# EAGLE design raspi-gsm-relais (EAGLE 6.4)
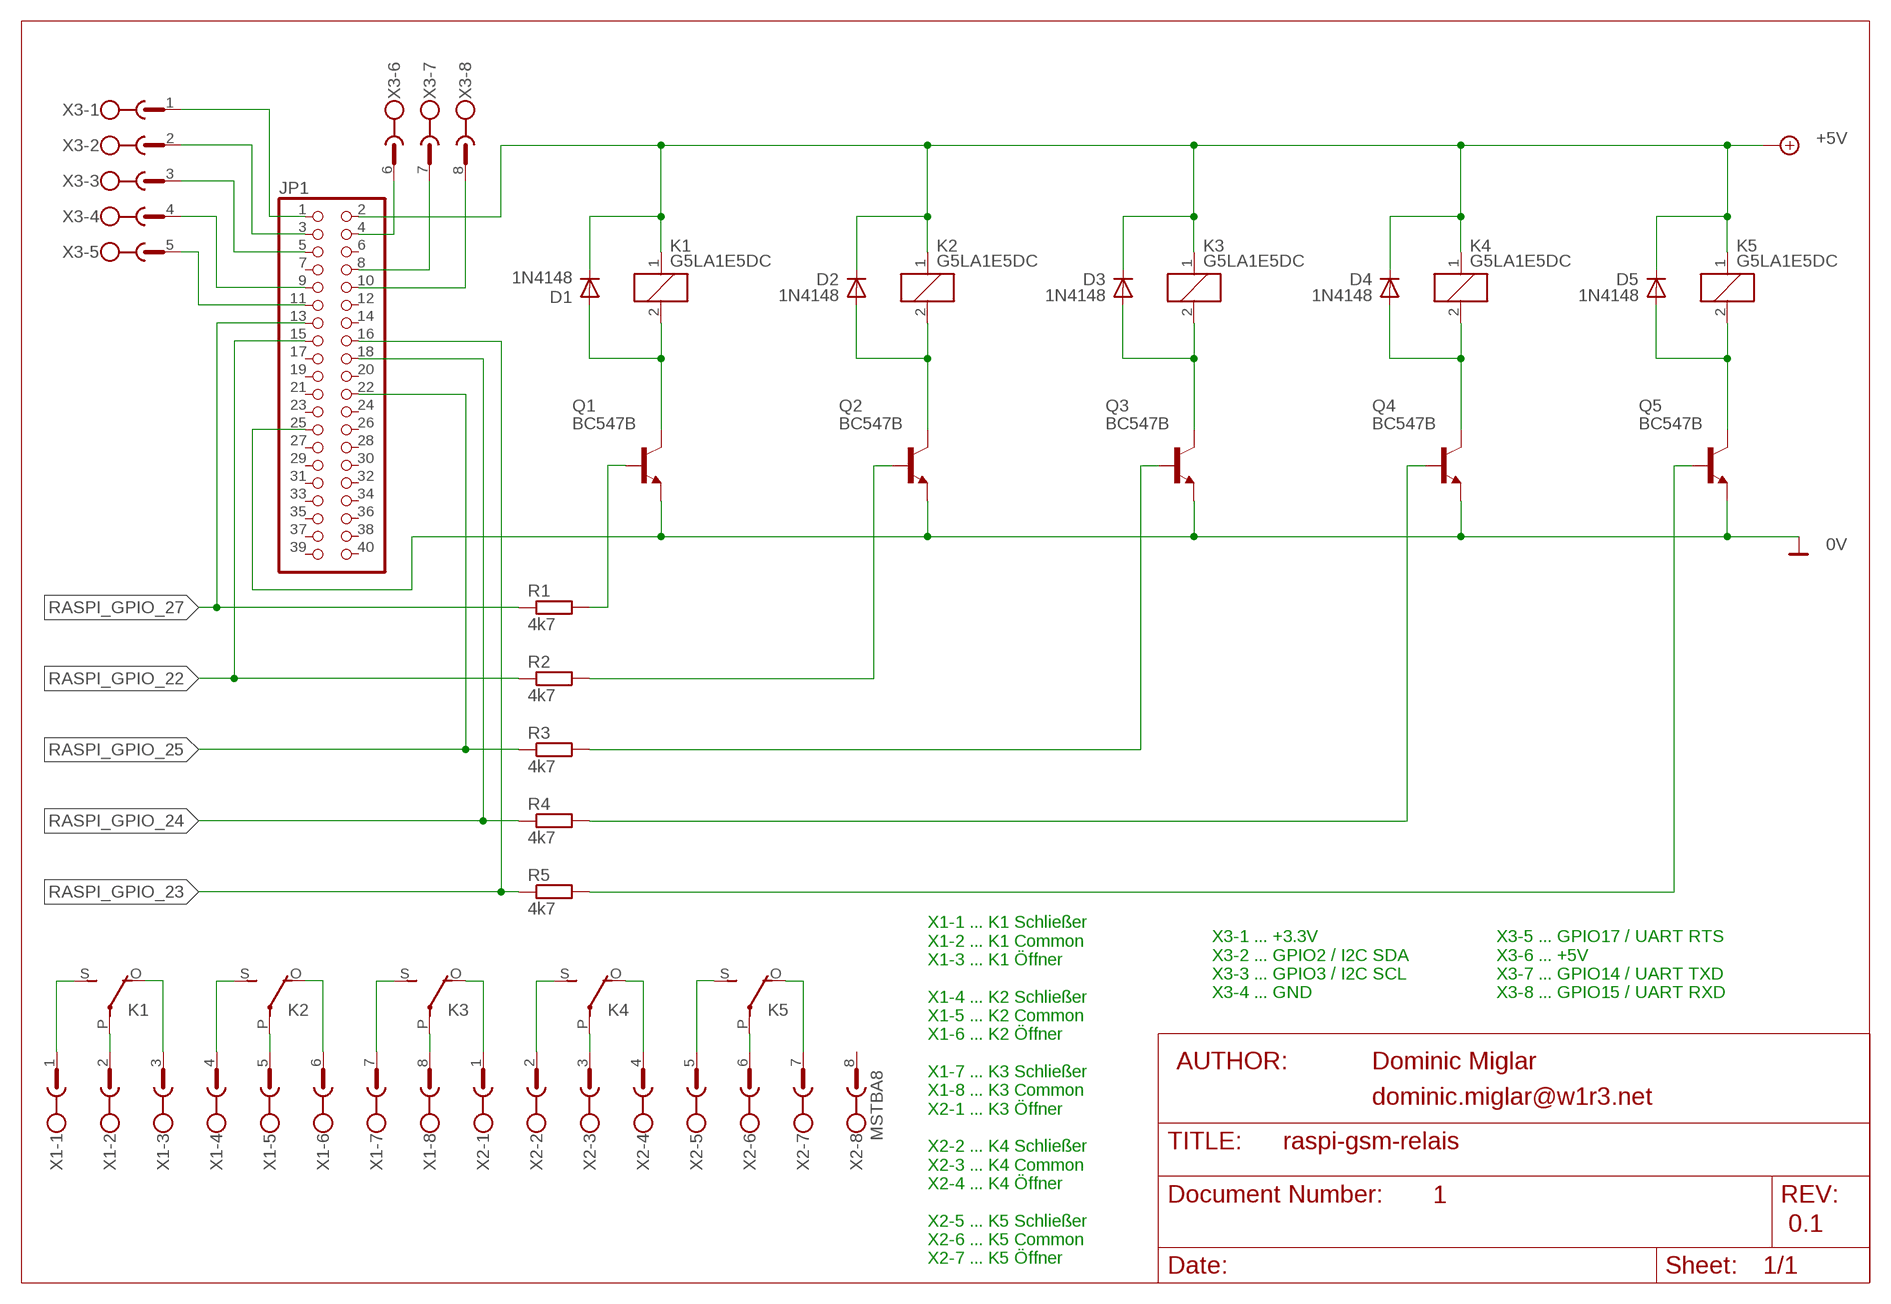
[diagram p0: schematic, sheet 1]

## Parts
D1  1N4148  1N4148DO35-10  [DO35-10]
D2  1N4148  1N4148DO35-10  [DO35-10]
D3  1N4148  1N4148DO35-10  [DO35-10]
D4  1N4148  1N4148DO35-10  [DO35-10]
D5  1N4148  1N4148DO35-10  [DO35-10]
JP1  PINHD-2X20  [2X20]
K1  G5LA1E5DC  G5L  [G5LE]
K2  G5LA1E5DC  G5L  [G5LE]
K3  G5LA1E5DC  G5L  [G5LE]
K4  G5LA1E5DC  G5L  [G5LE]
K5  G5LA1E5DC  G5L  [G5LE]
Q1  BC547B  [TO92]
Q2  BC547B  [TO92]
Q3  BC547B  [TO92]
Q4  BC547B  [TO92]
Q5  BC547B  [TO92]
R1  4k7  R-EU_0207/10  [0207/10]
R2  4k7  R-EU_0207/10  [0207/10]
R3  4k7  R-EU_0207/10  [0207/10]
R4  4k7  R-EU_0207/10  [0207/10]
R5  4k7  R-EU_0207/10  [0207/10]
X1  MSTBA8  [MSTBA8]
X2  MSTBA8  [MSTBA8]
X3  MSTBA8  [MSTBA8]

## Nets
0V: JP1.25 Q1.1(E) Q2.1(E) Q3.1(E) Q4.1(E) Q5.1(E)
+5V: D1.C D2.C D3.C D4.C D5.C JP1.2 K1.1 K2.1 K3.1 K4.1 K5.1
N$1: D1.A K1.2 Q1.3(C)
N$2: D2.A K2.2 Q2.3(C)
N$3: D3.A K3.2 Q3.3(C)
N$4: D4.A K4.2 Q4.3(C)
N$5: D5.A K5.2 Q5.3(C)
N$6: JP1.1 X3.1
N$7: Q2.2(B) R2.2
N$8: Q3.2(B) R3.2
N$9: Q4.2(B) R4.2
N$10: Q5.2(B) R5.2
N$11: K4.P(2:P) X2.3
N$12: K1.P(2:P) X1.2
N$13: K1.O(2:O) X1.3
N$14: K1.S(2:S) X1.1
N$15: K2.P(2:P) X1.5
N$16: K2.O(2:O) X1.6
N$17: K2.S(2:S) X1.4
N$18: K3.P(2:P) X1.8
N$19: K3.O(2:O) X2.1
N$20: K3.S(2:S) X1.7
N$21: K4.O(2:O) X2.4
N$22: K4.S(2:S) X2.2
N$23: K5.P(2:P) X2.6
N$24: K5.S(2:S) X2.5
N$25: K5.O(2:O) X2.7
N$26: Q1.2(B) R1.2
N$27: JP1.3 X3.2
N$28: JP1.5 X3.3
N$29: JP1.9 X3.4
N$30: JP1.11 X3.5
N$31: JP1.4 X3.6
N$32: JP1.8 X3.7
N$33: JP1.10 X3.8
RASPI_GPIO_22: JP1.15 R2.1
RASPI_GPIO_23: JP1.16 R5.1
RASPI_GPIO_24: JP1.18 R4.1
RASPI_GPIO_25: JP1.22 R3.1
RASPI_GPIO_27: JP1.13 R1.1
Unconnected: JP1.6 JP1.7 JP1.12 JP1.14 JP1.17 JP1.19 JP1.20 JP1.21 JP1.23 JP1.24 JP1.26 JP1.27 JP1.28 JP1.29 JP1.30 JP1.31 JP1.32 JP1.33 JP1.34 JP1.35 JP1.36 JP1.37 JP1.38 JP1.39 JP1.40 X2.8

## Notes on the sheet
- X3-1 ... +3.3V                 
  X3-2 ... GPIO2 / I2C SDA    
  X3-3 ... GPIO3 / I2C SCL     
  X3-4 ... GND
- X3-5 ... GPIO17 / UART RTS
  X3-6 ... +5V
  X3-7 ... GPIO14 / UART TXD
  X3-8 ... GPIO15 / UART RXD
- AUTHOR: | Dominic Miglar
- dominic.miglar@w1r3.net
- 1
- 0.1
- X1-1 ... K1 Schließer
  X1-2 ... K1 Common
  X1-3 ... K1 Öffner
  
  X1-4 ... K2 Schließer
  X1-5 ... K2 Common
  X1-6 ... K2 Öffner
  
  X1-7 ... K3 Schließer
  X1-8 ... K3 Common
  X2-1 ... K3 Öffner
  
  X2-2 ... K4 Schließer
  X2-3 ... K4 Common
  X2-4 ... K4 Öffner
  
  X2-5 ... K5 Schließer
  X2-6 ... K5 Common
  X2-7 ... K5 Öffner

## Library data of the parts
D1-D5 = diode:1N4148: DIODE high speed (Philips)
JP1 = pinhead:PINHD-2X20: PIN HEADER
K1-K5 = relay:G5L: RELAY 1 x switch, 10 A/120 V AC, 8 A/30 V ADC, Omron; OC_FARNELL: unknown; OC_NEWARK: unknown
Q1-Q5 = transistor-npn:BC547*: NPN Transistor
R1-R5 = rcl:R-EU_: RESISTOR, European symbol
X1-X3 = con-phoenix-508:MSTBA8: PHOENIX; MF: FARNELL; MPN: 1757307; OC_FARNELL: 3705225; OC_NEWARK: 71C4166

## Board
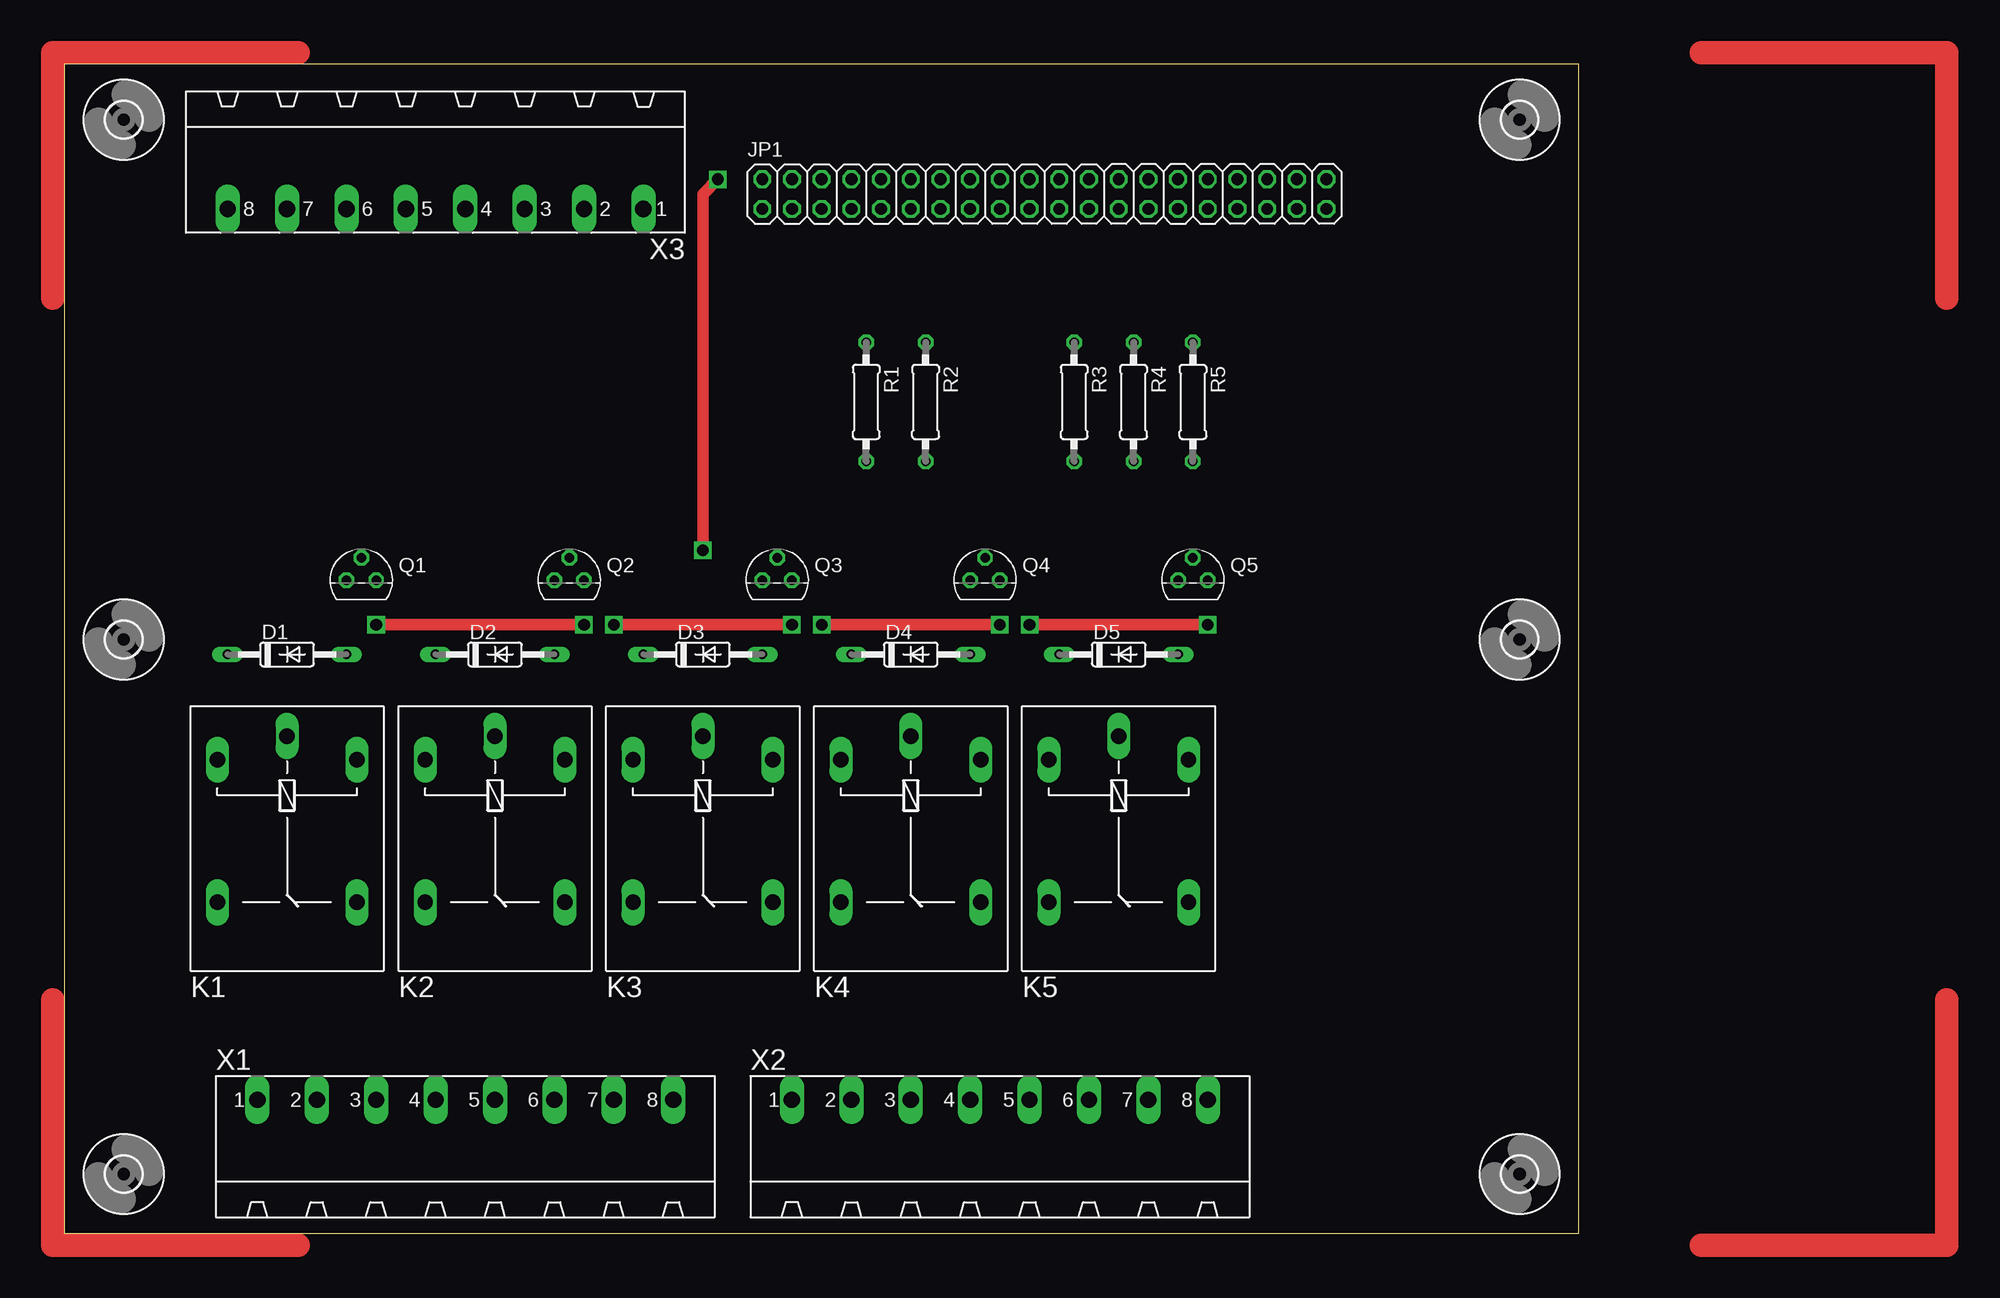
[diagram p1: board, top side]
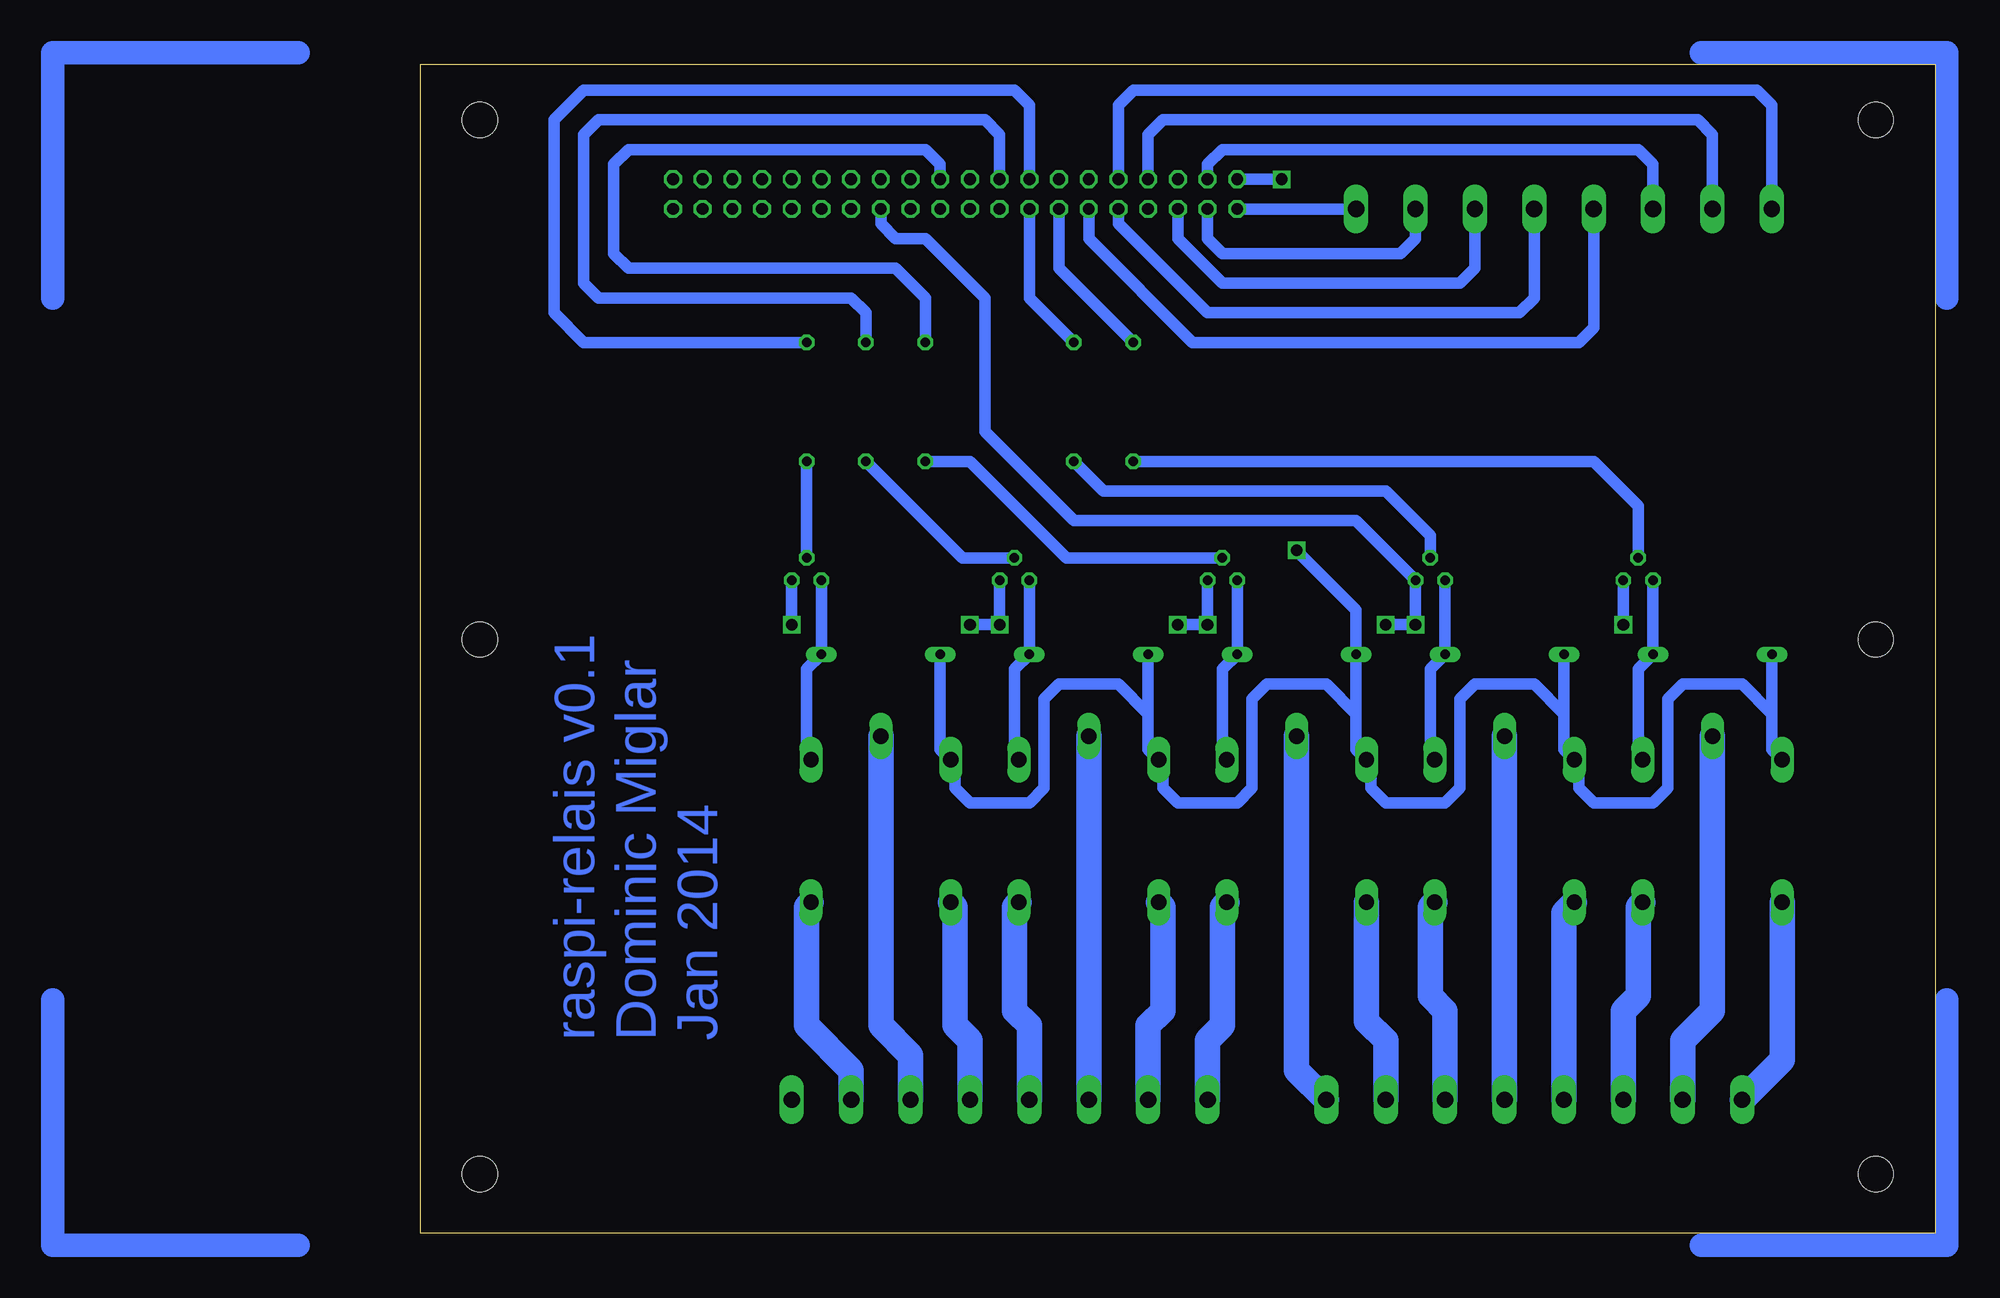
[diagram p2: board, bottom side, seen from below]

Size 129.52 x 100 mm. Coordinates in mm from the lower left corner, seen from the top.
Outline: 0,0 129.52,0 129.52,100 0,100 0,0
Copper layers (1*16): Top 0.035mm / dielectric 1.5mm / Bottom 0.035mm
Design rules "default": minimum track width 10mil, minimum drill 24mil, track to track 8mil, track to pad 8mil, pad to pad 8mil, via to via 8mil, smd to smd 8mil, copper to edge 40mil, drill to drill 8mil, minimum pad ring 10mil, minimum via ring 8mil, stop-mask expansion 4mil, vias tented up to drill 0mil, thermal gap 10mil

### Footprints (pad centres in the part's own frame; a part is rotated, then mirrored left to right if it is on the bottom)
DO35-10 = drill 0.813 long: A 5.08,0; C -5.08,0
2X20 = drill 1.016 octagon: 1 -24.13,-1.27; 2 -24.13,1.27; 3 -21.59,-1.27; 4 -21.59,1.27; 5 -19.05,-1.27; 6 -19.05,1.27; 7 -16.51,-1.27; 8 -16.51,1.27; 9 -13.97,-1.27; 10 -13.97,1.27; 11 -11.43,-1.27; 12 -11.43,1.27; 13 -8.89,-1.27; 14 -8.89,1.27; 15 -6.35,-1.27; 16 -6.35,1.27; 17 -3.81,-1.27; 18 -3.81,1.27; 19 -1.27,-1.27; 20 -1.27,1.27; 21 1.27,-1.27; 22 1.27,1.27; 23 3.81,-1.27; 24 3.81,1.27; 25 6.35,-1.27; 26 6.35,1.27; 27 8.89,-1.27; 28 8.89,1.27; 29 11.43,-1.27; 30 11.43,1.27; 31 13.97,-1.27; 32 13.97,1.27; 33 16.51,-1.27; 34 16.51,1.27; 35 19.05,-1.27; 36 19.05,1.27; 37 21.59,-1.27; 38 21.59,1.27; 39 24.13,-1.27; 40 24.13,1.27
G5LE = drill 1.321 long: 1 -7.493,-5.969; 2 -7.493,5.969; O 4.699,5.969; P -9.525,0; S 4.699,-5.969
TO92 = drill 0.813 octagon: 1 1.27,0; 2 0,1.905; 3 -1.27,0
0207/10 = drill 0.813 octagon: 1 -5.08,0; 2 5.08,0
3,0 = hole 3: 0,0
MSTBA8 = drill 1.397 long: 1 -17.78,5.08; 2 -12.7,5.08; 3 -7.62,5.08; 4 -2.54,5.08; 5 2.54,5.08; 6 7.62,5.08; 7 12.7,5.08; 8 17.78,5.08

### Placement (x,y rotation side)
D1  19.05,49.53 0 top
D2  36.83,49.53 0 top
D3  54.61,49.53 0 top
D4  72.39,49.53 0 top
D5  90.17,49.53 0 top
JP1  83.82,88.9 0 top
K1  19.05,33.02 270 top
K2  36.83,33.02 270 top
K3  54.61,33.02 270 top
K4  72.39,33.02 270 top
K5  90.17,33.02 270 top
Q1  25.4,55.88 0 top
Q2  43.18,55.88 0 top
Q3  60.96,55.88 0 top
Q4  78.74,55.88 0 top
Q5  96.52,55.88 0 top
R1  68.58,71.12 270 top
R2  73.66,71.12 270 top
R3  86.36,71.12 270 top
R4  91.44,71.12 270 top
R5  96.52,71.12 270 top
U$1  [3,0]  5.08,95.25 0 top
U$2  [3,0]  124.46,95.25 0 top
U$3  [3,0]  124.46,5.08 0 top
U$4  [3,0]  5.08,5.08 0 top
U$5  [3,0]  5.08,50.8 0 top
U$6  [3,0]  124.46,50.8 0 top
X1  34.29,6.35 0 top
X2  80.01,6.35 0 top
X3  31.75,92.71 180 top

### Tracks (layer width: path | path; a pad name or v marks a point on that pad's centre or on a via)
0V  (via drill 1)
  Top 1: v26.67,52.07 v44.45,52.07 | v62.23,52.07 v46.99,52.07 | v80.01,52.07 v64.77,52.07 | v97.79,52.07 v82.55,52.07
  Bottom 1: Q1.1 v26.67,52.07 | Q3.1 v62.23,52.07 v64.77,52.07 | v46.99,52.07 v44.45,52.07 Q2.1 49.53,60.96 73.66,60.96 81.28,68.58 81.28,80.01 86.36,85.09 88.9,85.09 90.17,86.36 JP1.25 | Q4.1 v80.01,52.07 v82.55,52.07 | Q5.1 v97.79,52.07
+5V  (via drill 1)
  Top 1: v55.88,90.17 54.61,88.9 v54.61,58.42
  Bottom 0.5: 49.53,41.4 49.53,43.18
  Bottom 1: 49.53,44.45 D3.C 49.53,53.34 v54.61,58.42 | D5.C 85.09,41.4 K5.1 83.82,40.13 83.82,38.1 82.55,36.83 77.47,36.83 76.2,38.1 76.2,45.72 74.93,46.99 69.85,46.99 67.31,44.45 | D1.C 13.97,44.45 | K1.1 13.97,41.4 13.97,44.45 | 13.97,44.45 16.51,46.99 21.59,46.99 22.86,45.72 22.86,38.1 24.13,36.83 29.21,36.83 30.48,38.1 30.48,40.13 K2.1 31.75,41.4 31.75,44.45 | D2.C 31.75,44.45 | 31.75,44.45 34.29,46.99 39.37,46.99 40.64,45.72 40.64,38.1 41.91,36.83 46.99,36.83 48.26,38.1 48.26,40.13 K3.1 49.53,41.4 49.53,44.45 | 49.53,44.45 52.07,46.99 57.15,46.99 58.42,45.72 58.42,38.1 59.69,36.83 64.77,36.83 66.04,38.1 66.04,40.13 K4.1 67.31,41.4 67.31,44.45 | D4.C 67.31,44.45 | JP1.2 v55.88,90.17
N$1
  Bottom 1: K1.2 25.4,40.89 25.4,48.26 D1.A Q1.3
N$2
  Bottom 1: K2.2 43.18,40.89 43.18,48.26 D2.A Q2.3
N$3
  Bottom 1: K3.2 60.96,40.89 60.96,48.26 D3.A Q3.3
N$4
  Bottom 1: K4.2 78.74,40.89 78.74,48.26 D4.A Q4.3
N$5
  Bottom 1: K5.2 96.52,40.89 96.52,48.26 D5.A Q5.3
N$6
  Bottom 1: X3.1 JP1.1
N$7
  Bottom 1: Q2.2 43.18,59.69 46.99,63.5 71.12,63.5 R2.2
N$8
  Bottom 1: Q3.2 74.3,57.78 82.55,66.04 R3.2
N$9
  Bottom 1: Q4.2 83.19,57.78 R4.2
N$10
  Bottom 1: R5.2 Q5.2
N$11
  Bottom 2.2: K4.P X2.3
N$12
  Bottom 2.2: K1.P 19.05,19.05 21.59,16.51 X1.2
N$13
  Bottom 2.2: X1.3 26.67,19.05 25.4,20.32 25.4,27.94 K1.O
N$14
  Bottom 2.2: K1.S 13.08,14.86 X1.1
N$15
  Bottom 2.2: K2.P X1.5
N$16
  Bottom 2.2: X1.6 41.91,19.05 43.18,20.32 43.18,27.94 K2.O
N$17
  Bottom 2.2: K2.S 31.75,27.43 X1.4
N$18
  Bottom 2.2: K3.P 54.61,13.97 X1.8
N$19
  Bottom 2.2: X2.1 62.23,16.51 60.96,17.78 60.96,27.94 K3.O
N$20
  Bottom 2.2: X1.7 46.99,16.51 48.64,18.16 K3.S
N$21
  Bottom 2.2: X2.4 77.47,17.78 78.74,19.05 78.74,27.94 K4.O
N$22
  Bottom 2.2: X2.2 67.31,17.78 66.04,19.05 66.04,27.94 K4.S
N$23
  Bottom 2.2: X2.6 87.63,15.24 90.17,17.78 K5.P
N$24
  Bottom 2.2: X2.5 82.55,16.51 83.82,17.78 83.82,27.94 K5.S
N$25
  Bottom 2.2: X2.7 92.71,13.97 96.52,17.78 96.52,27.94 K5.O
N$26
  Bottom 1: Q1.2 25.4,62.23 29.21,66.04 R1.2
N$27
  Bottom 1: X3.2 44.45,85.09 45.72,83.82 60.96,83.82 62.23,85.09 JP1.3
N$28
  Bottom 1: X3.3 39.37,82.55 40.64,81.28 60.96,81.28 64.77,85.09 JP1.5
N$29
  Bottom 1: X3.4 34.29,80.01 35.56,78.74 62.23,78.74 69.85,86.36 JP1.9
  Bottom 1.27: X3.4 34.29,86.36
N$30
  Bottom 1: X3.5 29.21,77.47 30.48,76.2 63.5,76.2 72.39,85.09 JP1.11
N$31
  Bottom 1: X3.6 24.13,91.44 25.4,92.71 60.96,92.71 62.23,91.44 JP1.4
N$32
  Bottom 1: X3.7 19.05,93.98 20.32,95.25 66.04,95.25 67.31,93.98 JP1.8
N$33
  Bottom 1: X3.8 13.97,96.52 15.24,97.79 68.58,97.79 69.85,96.52 JP1.10
N$34
  Top 2: 20,-1 -1,-1 -1,20
N$35
  Top 2: 140,-1 161,-1 161,20
N$36
  Top 2: 20,101 -1,101 -1,80
N$37
  Top 2: 161,80 161,101 140,101
N$38
  Bottom 2: 20,-1 -1,-1 -1,20
N$39
  Bottom 2: 140,-1 161,-1 161,20
N$40
  Bottom 2: 20,101 -1,101 -1,80
N$41
  Bottom 2: 161,80 161,101 140,101
RASPI_GPIO_22
  Bottom 1: JP1.15 77.47,80.01 R2.1
RASPI_GPIO_23
  Bottom 1: JP1.16 77.47,96.52 78.74,97.79 115.57,97.79 118.11,95.25 118.11,78.74 115.57,76.2 R5.1
RASPI_GPIO_24
  Bottom 1: JP1.18 80.01,93.98 81.28,95.25 114.3,95.25 115.57,93.98 115.57,81.28 114.3,80.01 92.71,80.01 91.44,78.74 R4.1
RASPI_GPIO_25
  Bottom 1: JP1.22 85.09,91.44 86.36,92.71 111.76,92.71 113.03,91.44 113.03,83.82 111.76,82.55 88.9,82.55 86.36,80.01 R3.1
RASPI_GPIO_27
  Bottom 1: JP1.13 74.93,82.55 R1.1

### Text on the board
Bottom: raspi-relais v0.1 / Dominic Miglar / Jan 2014